# Altium schematic sheet LM2596.SchDoc
size A; SheetNumber: 1; SheetTotal: 1
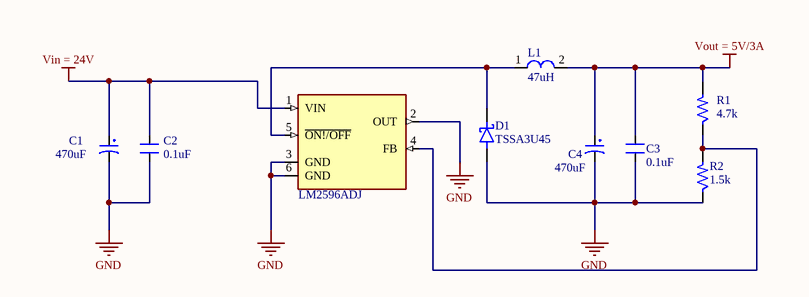
[diagram p0: LM2596.SchDoc]

## Parts
?  LM2596ADJ  [LM2596ADJ]
C1  470uF  [CP1.5/3.4]
C2  0.1uF  [CN3]
C3  0.1uF  [CN3]
C4  470uF  [CP1.5/3.4]
D1  TSSA3U45  [DIOM4325X250N]
L1  47uH  [L-SMD-M-7.3x4.5]
R1  4.7k  [SM-1206]
R2  1.5k  [SM-1206]

## Nets
GND: ?.2(OUT) ?.3(GND) ?.6(GND) C1.2 C2.1 C3.1 C4.2 D1.A R2.1
Vin = 24V: ?.1(VIN) C1.1 C2.2
Vout = 5V/3A: C3.2 C4.1 L1.2 R1.2
Net?_4: ?.4(FB) R1.1 R2.2
Net?_5: ?.5(~{ON!/OFF}) D1.C(K) L1.1

## Library data of the parts
? = LM2596ADJ: MP: LM2596-ADJ; MF: First Components; SnapEDA_Link: https://www.snapeda.com/parts/LM2596-ADJ/First%20Components/view-part/557542/?ref=snap; Availability: Unavailable; Price: None; Value: *; Package: None
C1 C4 = CP3: Cap 100uF/35V - 470uF/16V; Value: 100uF/35V/50V; Description 1: 1000uF/6,3V - 470uF/16V - 330uF - 25V; Description 2: 220uF/35V - 100uF/50V - 63V - 4,7uF/200V; Description 3: 22uF => 33uF100V - 3,3uF => 4,7uF/250V; Description 4: 2,2uF =>3,3uF/350 - 2,2uF/400V - 1uF/450V
C2 C3 = CN3: Cap np W0.3; Value: 0,047uF; Copyright: VanDungEvn
L1 = L-SMD-1: partNo: 78477010; Manufacturer: Wurth Elektronik; Inductance: 1.0 μH; ComponentLink1Description: Manufacturer; ComponentLink1URL: http://www.we-online.de; Created by: Baojun Chen; Created Date: Nov.2015; ComponentLink2Description: Datasheet; ComponentLink2URL: http://katalog.we-online.de/pbs/datasheet/78477010.pdf
R1 R2 = R: Resistor 1/4W; Value: R1/4W - 1K
D1 = TSSA3U45: Package: None; Availability: Unavailable; Value: *; MP: TSSA3U45; Price: None